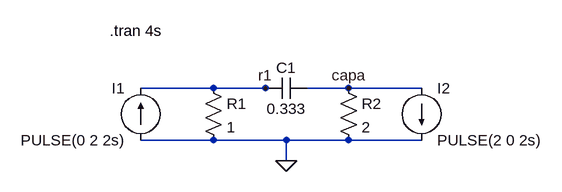
[diagram p0: schematic B23.asc]
B23.asc, the LTspice schematic file:
Version 4
SHEET 1 880 680
WIRE 128 128 16 128
WIRE 208 128 128 128
WIRE 224 128 208 128
WIRE 336 128 272 128
WIRE 448 128 336 128
WIRE 128 208 16 208
WIRE 240 208 128 208
WIRE 336 208 240 208
WIRE 448 208 336 208
WIRE 240 240 240 208
FLAG 240 240 0
FLAG 208 128 r1
FLAG 336 128 capa
SYMBOL current 16 208 R180
WINDOW 0 24 80 Left 2
WINDOW 3 24 0 Left 2
WINDOW 123 0 0 Left 0
WINDOW 39 0 0 Left 0
SYMATTR InstName I1
SYMATTR Value PULSE(0 2 2s)
SYMBOL current 448 128 R0
WINDOW 123 0 0 Left 0
WINDOW 39 0 0 Left 0
SYMATTR InstName I2
SYMATTR Value PULSE(2 0 2s)
SYMBOL res 112 112 R0
SYMATTR InstName R1
SYMATTR Value 1
SYMBOL res 320 112 R0
SYMATTR InstName R2
SYMATTR Value 2
SYMBOL cap 272 112 R90
WINDOW 0 0 32 VBottom 2
WINDOW 3 32 32 VTop 2
SYMATTR InstName C1
SYMATTR Value 0.333
TEXT -32 40 Left 2 !.tran 4s

The netlist it stands for:
* B23.asc
I1 0 r1 PULSE(0 2 2s)
I2 capa 0 PULSE(2 0 2s)
R1 r1 0 1
R2 capa 0 2
C1 capa r1 0.333
.tran 4s
.backanno
.end